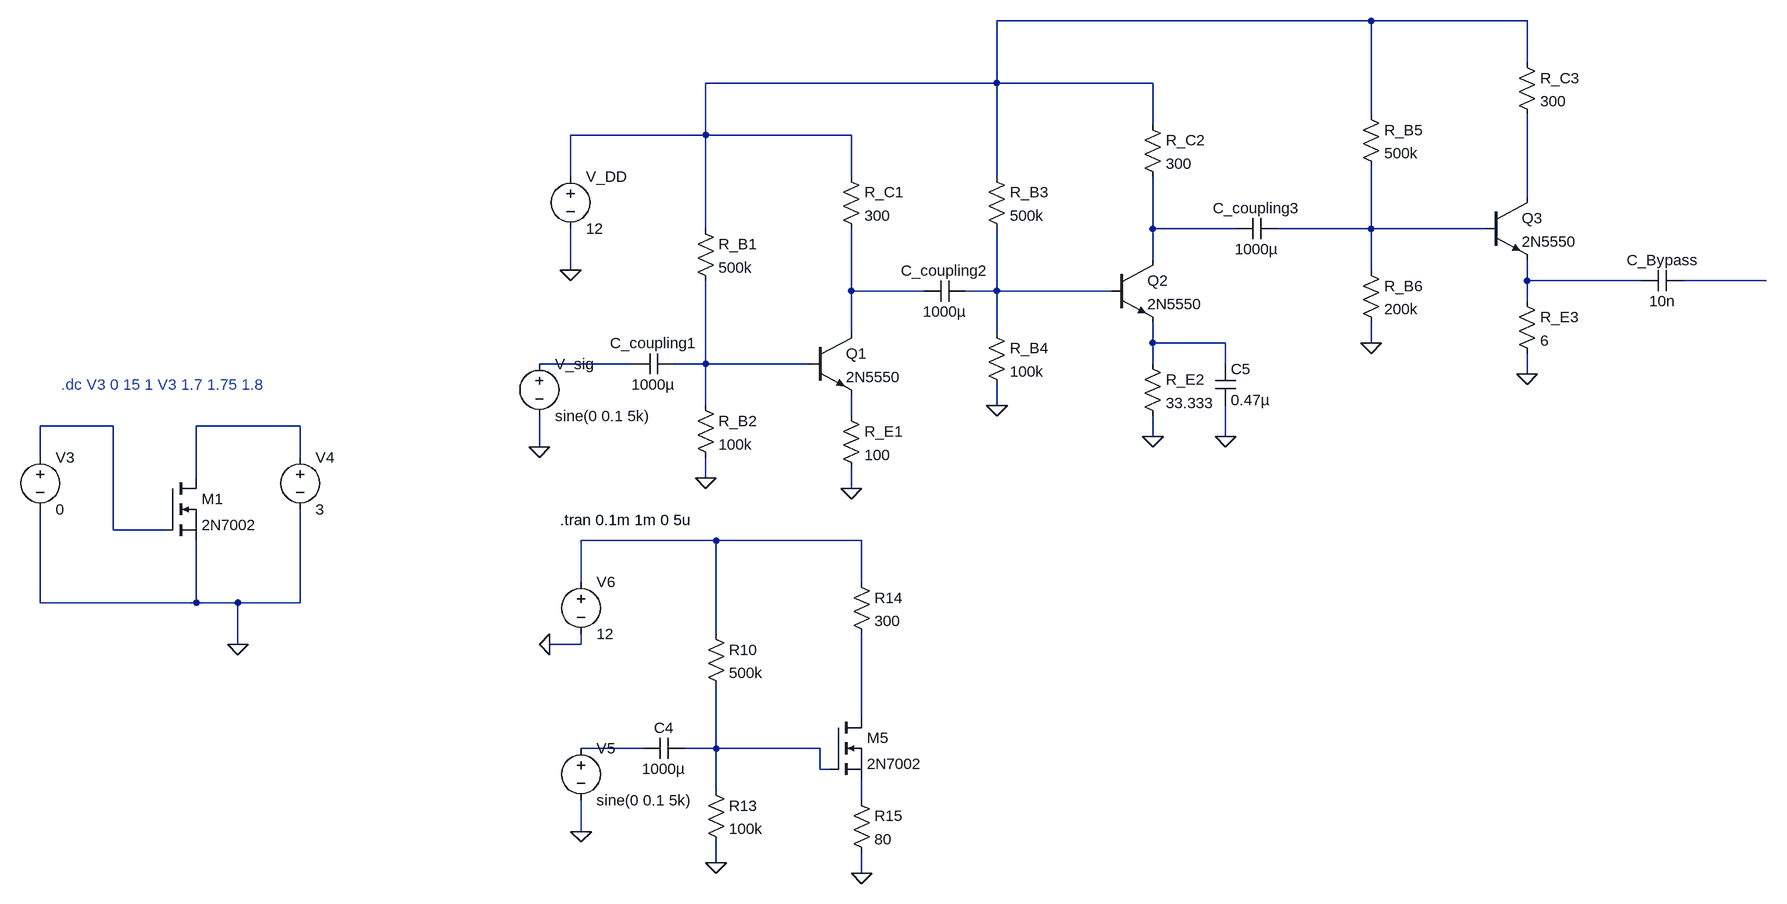
[diagram p0: schematic AudioAmplifier_V2_2N5551_NPN_amplifier.asc]
AudioAmplifier_V2_2N5551_NPN_amplifier.asc, the LTspice schematic file:
Version 4
SHEET 1 1732 1156
WIRE 1088 -176 512 -176
WIRE 1328 -176 1088 -176
WIRE 1328 -112 1328 -176
WIRE 512 -80 512 -176
WIRE 512 -80 64 -80
WIRE 752 -80 512 -80
WIRE 1088 -32 1088 -176
WIRE 752 -16 752 -80
WIRE 64 0 64 -80
WIRE 64 0 -144 0
WIRE 288 0 64 0
WIRE -144 64 -144 0
WIRE 288 64 288 0
WIRE 512 64 512 -80
WIRE 1328 96 1328 -32
WIRE 64 144 64 0
WIRE 752 144 752 64
WIRE 880 144 752 144
WIRE 1088 144 1088 48
WIRE 1088 144 944 144
WIRE 1264 144 1088 144
WIRE 752 192 752 144
WIRE -144 208 -144 144
WIRE 1088 208 1088 144
WIRE 1328 224 1328 192
WIRE 1504 224 1328 224
WIRE 1696 224 1568 224
WIRE 288 240 288 144
WIRE 400 240 288 240
WIRE 512 240 512 144
WIRE 512 240 464 240
WIRE 688 240 512 240
WIRE 1328 256 1328 224
WIRE 288 304 288 240
WIRE 512 304 512 240
WIRE 752 320 752 288
WIRE 864 320 752 320
WIRE 1088 320 1088 288
WIRE -48 352 -192 352
WIRE 64 352 64 224
WIRE 64 352 16 352
WIRE 224 352 64 352
WIRE 752 352 752 320
WIRE 864 352 864 320
WIRE 1328 368 1328 336
WIRE 64 416 64 352
WIRE 512 416 512 384
WIRE 288 432 288 400
WIRE -848 448 -960 448
WIRE -560 448 -720 448
WIRE 752 464 752 432
WIRE 864 464 864 416
WIRE -192 480 -192 432
WIRE -960 496 -960 448
WIRE -560 496 -560 448
WIRE -720 528 -720 448
WIRE 64 528 64 496
WIRE 288 544 288 512
WIRE -848 608 -848 448
WIRE -768 608 -848 608
WIRE 80 624 -128 624
WIRE 304 624 80 624
WIRE -128 688 -128 624
WIRE 304 688 304 624
WIRE -960 720 -960 576
WIRE -720 720 -720 624
WIRE -720 720 -960 720
WIRE -656 720 -720 720
WIRE -560 720 -560 576
WIRE -560 720 -656 720
WIRE 80 768 80 624
WIRE -656 784 -656 720
WIRE -128 784 -128 768
WIRE -128 784 -176 784
WIRE 304 896 304 768
WIRE -32 944 -128 944
WIRE 80 944 80 848
WIRE 80 944 32 944
WIRE 240 944 80 944
WIRE 240 976 240 944
WIRE 256 976 240 976
WIRE 80 1008 80 944
WIRE 304 1024 304 992
WIRE -128 1072 -128 1024
WIRE 80 1120 80 1088
WIRE 304 1136 304 1104
FLAG -144 208 0
FLAG -192 480 0
FLAG 64 528 0
FLAG -656 784 0
FLAG 288 544 0
FLAG 512 416 0
FLAG 752 464 0
FLAG 1088 320 0
FLAG 1328 368 0
FLAG -176 784 0
FLAG -128 1072 0
FLAG 80 1120 0
FLAG 304 1136 0
FLAG 864 464 0
SYMBOL voltage -192 336 R0
SYMATTR InstName V_sig
SYMATTR Value sine(0 0.1 5k)
SYMBOL voltage -144 48 R0
SYMATTR InstName V_DD
SYMATTR Value 12
SYMBOL Res 48 128 R0
SYMATTR InstName R_B1
SYMATTR Value 500k
SYMBOL Res 48 400 R0
SYMATTR InstName R_B2
SYMATTR Value 100k
SYMBOL Res 272 48 R0
SYMATTR InstName R_C1
SYMATTR Value 300
SYMBOL voltage -960 480 R0
SYMATTR InstName V3
SYMATTR Value 0
SYMBOL voltage -560 480 R0
SYMATTR InstName V4
SYMATTR Value 3
SYMBOL nmos -768 528 R0
SYMATTR InstName M1
SYMATTR Value 2N7002
SYMBOL cap 16 336 R90
WINDOW 0 0 32 VBottom 2
WINDOW 3 32 32 VTop 2
SYMATTR InstName C_coupling1
SYMATTR Value 1000µ
SYMBOL res 272 416 R0
SYMATTR InstName R_E1
SYMATTR Value 100
SYMBOL Res 496 48 R0
SYMATTR InstName R_B3
SYMATTR Value 500k
SYMBOL Res 496 288 R0
SYMATTR InstName R_B4
SYMATTR Value 100k
SYMBOL Res 736 -32 R0
SYMATTR InstName R_C2
SYMATTR Value 300
SYMBOL res 736 336 R0
SYMATTR InstName R_E2
SYMATTR Value 33.333
SYMBOL Res 1072 -48 R0
SYMATTR InstName R_B5
SYMATTR Value 500k
SYMBOL Res 1072 192 R0
SYMATTR InstName R_B6
SYMATTR Value 200k
SYMBOL Res 1312 -128 R0
SYMATTR InstName R_C3
SYMATTR Value 300
SYMBOL res 1312 240 R0
SYMATTR InstName R_E3
SYMATTR Value 6
SYMBOL cap 464 224 R90
WINDOW 0 0 32 VBottom 2
WINDOW 3 32 32 VTop 2
SYMATTR InstName C_coupling2
SYMATTR Value 1000µ
SYMBOL cap 944 128 R90
WINDOW 0 0 32 VBottom 2
WINDOW 3 32 32 VTop 2
SYMATTR InstName C_coupling3
SYMATTR Value 1000µ
SYMBOL cap 1568 208 R90
WINDOW 0 0 32 VBottom 2
WINDOW 3 32 32 VTop 2
SYMATTR InstName C_Bypass
SYMATTR Value 10n
SYMBOL voltage -128 928 R0
SYMATTR InstName V5
SYMATTR Value sine(0 0.1 5k)
SYMBOL voltage -128 672 R0
SYMATTR InstName V6
SYMATTR Value 12
SYMBOL Res 64 752 R0
SYMATTR InstName R10
SYMATTR Value 500k
SYMBOL Res 64 992 R0
SYMATTR InstName R13
SYMATTR Value 100k
SYMBOL Res 288 672 R0
SYMATTR InstName R14
SYMATTR Value 300
SYMBOL cap 32 928 R90
WINDOW 0 0 32 VBottom 2
WINDOW 3 32 32 VTop 2
SYMATTR InstName C4
SYMATTR Value 1000µ
SYMBOL res 288 1008 R0
SYMATTR InstName R15
SYMATTR Value 80
SYMBOL nmos 256 896 R0
SYMATTR InstName M5
SYMATTR Value 2N7002
SYMBOL npn 224 304 R0
SYMATTR InstName Q1
SYMATTR Value 2N5550
SYMBOL npn 688 192 R0
SYMATTR InstName Q2
SYMATTR Value 2N5550
SYMBOL npn 1264 96 R0
SYMATTR InstName Q3
SYMATTR Value 2N5550
SYMBOL cap 848 352 R0
SYMATTR InstName C5
SYMATTR Value 0.47µ
TEXT -928 384 Left 2 ;.dc V3 0 15 1 V3 1.7 1.75 1.8
TEXT -160 592 Left 2 !.tran 0.1m 1m 0 5u

The netlist it stands for:
* AudioAmplifier_V2_2N5551_NPN_amplifier.asc
V_sig N010 0 sine(0 0.1 5k)
V_DD N001 0 12
R_B1 N001 N011 500k
R_B2 N011 0 100k
R_C1 N001 N007 300
V3 N013 0 0
V4 N014 0 3
M1 N014 N013 0 0 2N7002
C_coupling1 N011 N010 1000µ
R_E1 N012 0 100
R_B3 N001 N008 500k
R_B4 N008 0 100k
R_C2 N001 N003 300
R_E2 N009 0 33.333
R_B5 N001 N004 500k
R_B6 N004 0 200k
R_C3 N001 N002 300
R_E3 N005 0 6
C_coupling2 N008 N007 1000µ
C_coupling3 N004 N003 1000µ
C_Bypass N006 N005 10n
V5 N017 0 sine(0 0.1 5k)
V6 N015 0 12
R10 N015 N018 500k
R13 N018 0 100k
R14 N015 N016 300
C4 N018 N017 1000µ
R15 N019 0 80
M5 N016 N018 N019 N019 2N7002
Q1 N007 N011 N012 0 2N5550
Q2 N003 N008 N009 0 2N5550
Q3 N002 N004 N005 0 2N5550
C5 N009 0 0.47µ
.model NPN NPN
.model PNP PNP
.lib standard.bjt
.model NMOS NMOS
.model PMOS PMOS
.lib standard.mos
* .dc V3 0 15 1 V3 1.7 1.75 1.8
.tran 0.1m 1m 0 5u
.backanno
.end